# Altium project pca10031.PrjPCB
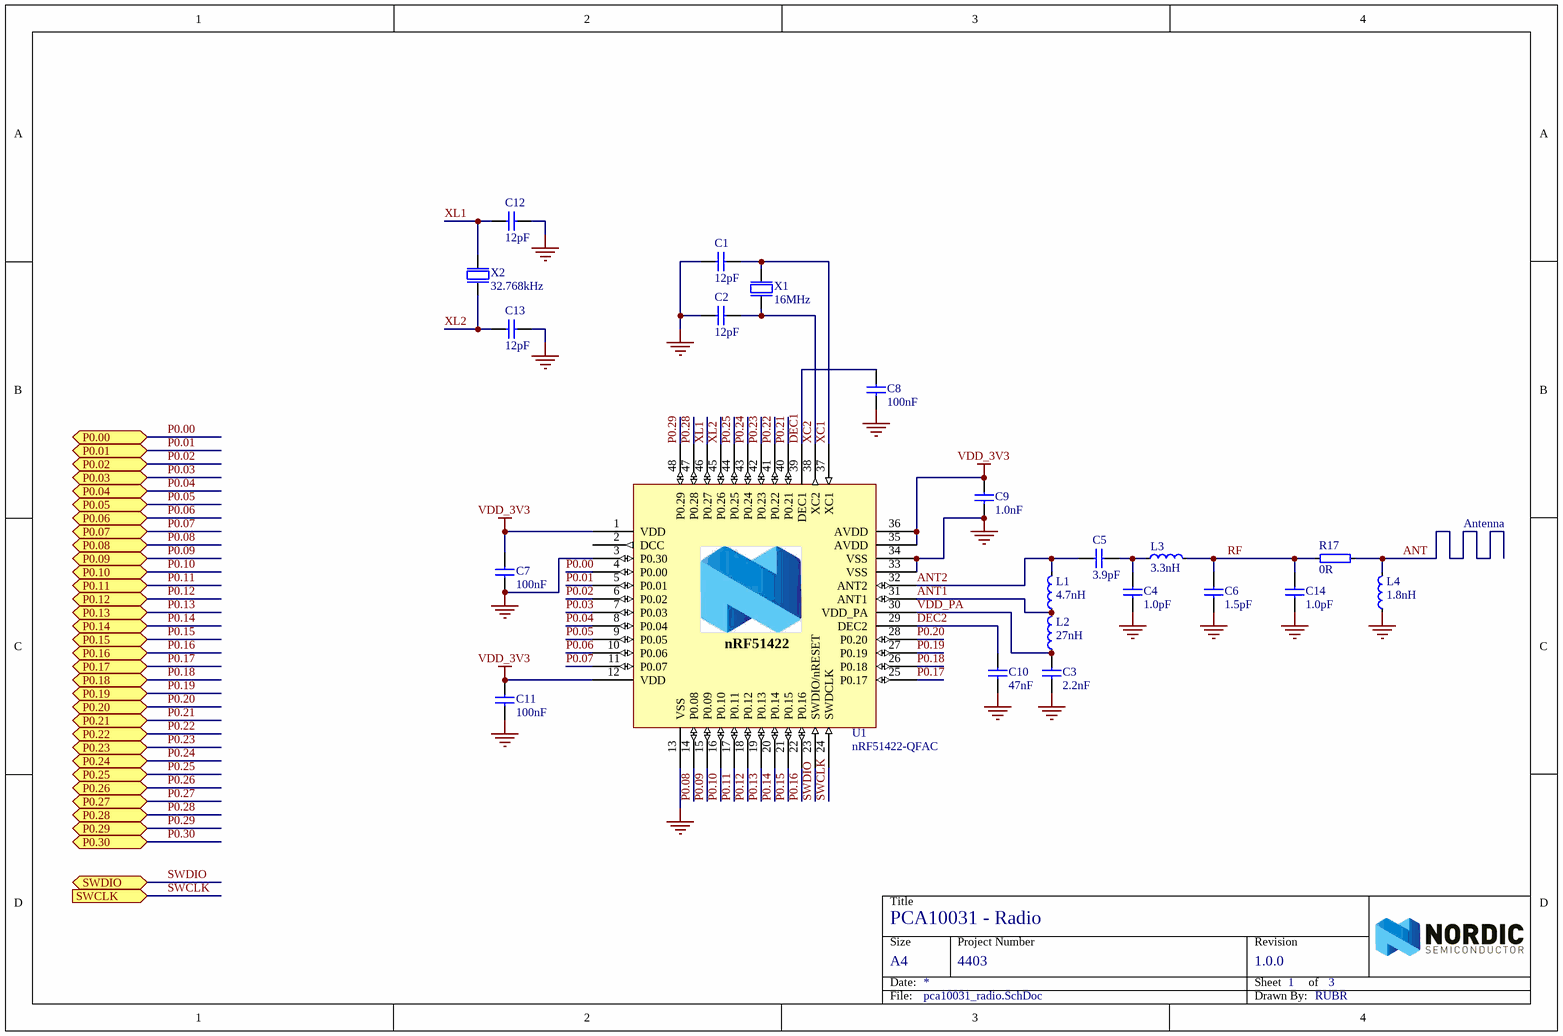
[diagram p0: pca10031_radio.SchDoc]
3 sheets, 78 parts. Net scope: flat (ports and power ports of the same name join across sheets).
Board file: 400101.PcbDoc
Sheets:
  pca10031_radio.SchDoc
  pca10031_interface_mcu.SchDoc
  pca10031_misc.SchDoc

## Sheet pca10031_radio.SchDoc: PCA10031 - Radio
size A4; Revision: 1.0.0; SheetNumber: 1; SheetTotal: 3; DrawnBy: RUBR; ProjectNumber: 4403; PCBRevision: 0168RUBR; DocumentSize: A4; PCAName: PCA10031; PCBNumber: 400101; ProjectName: Cost optimized nRF51-EK

### Parts
C1  12pF  [CAPC1005X04L]
C2  12pF  [CAPC1005X04L]
C3  2.2nF  [CAPC1005X04L]
C4  1.0pF  [CAPC1005X04L]
C5  3.9pF  [CAPC1005X04L]
C6  1.5pF  [CAPC1005X04L]
C7  100nF  [CAPC1005X04L]
C8  100nF  [CAPC1005X04L]
C9  1.0nF  [CAPC1005X04L]
C10  47nF  [CAPC1005X04L]
C11  100nF  [CAPC1005X04L]
C12  12pF  [CAPC1005X04L]
C13  12pF  [CAPC1005X04L]
C14  1.0pF  [CAPC1005X04L]
L1  4.7nH  [INDC1005X04L]
L2  27nH  [INDC1005X04L]
L3  3.3nH  [INDC1005X04L]
L4  1.8nH  [INDC1005X04L]
R17  0R  [RESC1005X04L]
U1  nRF51422-QFAC  [QFN40P600X600X90-48N]
X1  16MHz  [BT-XTAL_2520]
X2  32.768kHz  [XTAL_3215]

### Ports
P0.00 (bidir), P0.01 (bidir), P0.02 (bidir), P0.03 (bidir), P0.04 (bidir), P0.05 (bidir), P0.06 (bidir), P0.07 (bidir), P0.08 (bidir), P0.09 (bidir), P0.10 (bidir), P0.11 (bidir), P0.12 (bidir), P0.13 (bidir), P0.14 (bidir), P0.15 (bidir), P0.16 (bidir), P0.17 (bidir), P0.18 (bidir), P0.19 (bidir), P0.20 (bidir), P0.21 (bidir), P0.22 (bidir), P0.23 (bidir), P0.24 (bidir), P0.25 (bidir), P0.26 (bidir), P0.27 (bidir), P0.28 (bidir), P0.29 (bidir), P0.30 (bidir), SWCLK (in), SWDIO (bidir)

### Nets
GND: C1.2 C2.2 C3.2 C4.2 C6.2 C7.2 C8.2 C9.2 C10.2 C11.2 C12.2 C13.2 C14.2 L4.1 U1.3(P0.30) U1.13(VSS) U1.33(VSS) U1.34(VSS) U1.49 X1.2(GND) X1.4(GND)
VDD_3V3: C7.1 C9.1 C11.1 U1.1(VDD) U1.12(VDD) U1.35(AVDD) U1.36(AVDD)
ANT: L4.2 R17.2
ANT1: L1.1 L2.2 U1.31(ANT1)
ANT2: C5.1 L1.2 U1.32(ANT2)
DEC1: C8.1 U1.39(DEC1)
DEC2: C10.1 U1.29(DEC2)
P0.00: U1.4(P0.00) ; port P0.00
P0.01: U1.5(P0.01) ; port P0.01
P0.02: U1.6(P0.02) ; port P0.02
P0.03: U1.7(P0.03) ; port P0.03
P0.04: U1.8(P0.04) ; port P0.04
P0.05: U1.9(P0.05) ; port P0.05
P0.06: U1.10(P0.06) ; port P0.06
P0.07: U1.11(P0.07) ; port P0.07
P0.08: U1.14(P0.08) ; port P0.08
P0.09: U1.15(P0.09) ; port P0.09
P0.10: U1.16(P0.10) ; port P0.10
P0.11: U1.17(P0.11) ; port P0.11
P0.12: U1.18(P0.12) ; port P0.12
P0.13: U1.19(P0.13) ; port P0.13
P0.14: U1.20(P0.14) ; port P0.14
P0.15: U1.21(P0.15) ; port P0.15
P0.16: U1.22(P0.16) ; port P0.16
P0.17: U1.25(P0.17) ; port P0.17
P0.18: U1.26(P0.18) ; port P0.18
P0.19: U1.27(P0.19) ; port P0.19
P0.20: U1.28(P0.20) ; port P0.20
P0.21: U1.40(P0.21) ; port P0.21
P0.22: U1.41(P0.22) ; port P0.22
P0.23: U1.42(P0.23) ; port P0.23
P0.24: U1.43(P0.24) ; port P0.24
P0.25: U1.44(P0.25) ; port P0.25
P0.26: port P0.26
P0.27: port P0.27
P0.28: U1.47(P0.28) ; port P0.28
P0.29: U1.48(P0.29) ; port P0.29
P0.30: port P0.30
RF: C6.1 C14.1 L3.2 R17.1
SWCLK: U1.24(SWDCLK) ; port SWCLK
SWDIO: U1.23(SWDIO/nRESET) ; port SWDIO
VDD_PA: C3.1 L2.1 U1.30(VDD_PA)
XC1: C1.1 U1.37(XC1) X1.1(inp)
XC2: C2.1 U1.38(XC2) X1.3(out)
XL1: C12.1 U1.46(P0.27) X2.1(inp)
XL2: C13.1 U1.45(P0.26) X2.2(out)
NetC4_1: C4.1 C5.2 L3.1

Not connected (* = marked no-connect by the designer): U1 2(DCC)

### Notes on the sheet
- Antenna
- Title
- Size
- Date:
- Project Number
- Sheet         of
- Revision
- File:
- Drawn By:
- (in symbol nRF51422-QFAC-XLR3+) nRF51422

### Library data of the parts
C1 C2 C12 C13 = C0402-12p: Capacitor, NP0, ±2%; Note: 50V; Artikkelnr Noca: 20029159; Artikkelnr Simpro: N.A.; Part Number: C0402-12p; Manufacturer: *; Manufacturer Part Number: *; Datasheet: *; LatestRevisionDate: 2011-05-11; Pin Count: 2; Publisher: Nordic Semiconductor; Published: 2009-05-08; Value: 12pF; Supplier: *; Supplier part number: *; 2nd source Supplier: *; 2nd source part number: *; Footprint Doc: 0402
C3 = C0402-2n2: Capacitor, X7R, ±10%; Note: 50V; Artikkelnr Noca: 20039221; Artikkelnr Simpro: N.A.; Part Number: C0402-2n2; Manufacturer: *; Manufacturer Part Number: *; Datasheet: *; LatestRevisionDate: 2009-11-23; Pin Count: 2; Publisher: Nordic Semiconductor; Published: 2009-05-08; Value: 2.2nF; Supplier: *; Supplier part number: *; 2nd source Supplier: *; 2nd source part number: *; Footprint Doc: 0402
C4 C14 = C0402-1.0p: Capacitor, NP0, ±0.1pF; Note: 50V; Artikkelnr Noca: 20029140; Artikkelnr Simpro: N.A.; Part Number: C0402-1.0p; Manufacturer: *; Manufacturer Part Number: *; Datasheet: *; LatestRevisionDate: 2009-11-23; Pin Count: 2; Publisher: Nordic Semiconductor; Published: 2009-05-08; Value: 1.0pF; Supplier: *; Supplier part number: *; 2nd source Supplier: *; 2nd source part number: *; Footprint Doc: 0402
C5 = C0402-3.9p: Capacitor, NP0, ±0.1pF; Note: 50V; Artikkelnr Noca: N.A.; Part Number: C0402-3.9p; Manufacturer: *; Manufacturer Part Number: *; Datasheet: *; LatestRevisionDate: 2014-09-17; Pin Count: 2; Publisher: Nordic Semiconductor; Published: 2009-05-08; Value: 3.9pF; Supplier: *; Supplier part number: *; 2nd source Supplier: *; 2nd source part number: *; Footprint Doc: 0402; Artikkelnr Simpro: N.A.
C6 = C0402-1.5p: Capacitor, NP0, ±0.1pF; Note: 50V; Artikkelnr Noca: 20029139; Artikkelnr Simpro: N.A.; Part Number: C0402-1.5p; Manufacturer: *; Manufacturer Part Number: *; Datasheet: *; LatestRevisionDate: 2009-11-23; Pin Count: 2; Publisher: Nordic Semiconductor; Published: 2009-05-08; Value: 1.5pF; Supplier: *; Supplier part number: *; 2nd source Supplier: *; 2nd source part number: *; Footprint Doc: 0402
C7 C8 C11 = C0402-100n: Capacitor, X7R, ±10%; Note: 16V; Artikkelnr Noca: 20039200; Artikkelnr Simpro: N.A.; Part Number: C0402-100n; Manufacturer: *; Manufacturer Part Number: *; Datasheet: *; LatestRevisionDate: 2009-11-23; Pin Count: 2; Publisher: Nordic Semiconductor; Published: 2009-05-08; Value: 100nF; Supplier: *; Supplier part number: *; 2nd source Supplier: *; 2nd source part number: *; Footprint Doc: 0402
C9 = C0402-1n0: Capacitor, X7R, ±10%; Note: 50V; Artikkelnr Noca: 20039223; Artikkelnr Simpro: N.A.; Part Number: C0402-1n0; Manufacturer: *; Manufacturer Part Number: *; Datasheet: *; LatestRevisionDate: 2009-11-23; Pin Count: 2; Publisher: Nordic Semiconductor; Published: 2009-05-08; Value: 1.0nF; Supplier: *; Supplier part number: *; 2nd source Supplier: *; 2nd source part number: *; Footprint Doc: 0402
C10 = C0402-47n: Capacitor, X7R, ±10%; Note: Chip Cap 10%; Artikkelnr Noca: 20039389; Artikkelnr Simpro: N.A.; Part Number: C0402-47n; Manufacturer: *; Manufacturer Part Number: *; Datasheet: *; LatestRevisionDate: 2009-05-08; Pin Count: 2; Publisher: Nordic Semiconductor; Published: 2009-05-08; Value: 47nF; Supplier: *; Supplier part number: *; 2nd source Supplier: *; 2nd source part number: *; Footprint Doc: 0402
L1 = L0402-4n7: Inductor, 160mA, ±0.1nH; Manufacturer: Murata; Manufacturer Part Number: LQP15MN4N7B02D; Note: High frequency chip inductor ±5%; Artikkelnr Noca: 33029164; Artikkelnr Simpro: N.A.; Part Number: L0402-4n7; Datasheet: http://search.murata.co.jp/Ceramy/image/img/PDF/ENG/L0075S0084LQP15M.pdf; LatestRevisionDate: 2012-09-19; Pin Count: 2; Publisher: Nordic Semiconductor; Published: 2009-05-08; Value: 4.7nH; Supplier: Digi-Key; Supplier part number: 490-1132-1-ND; 2nd source Supplier: *; 2nd source part number: *; Footprint Doc: 0402
L2 = L0402-27n: Inductor, 70mA, ±2%; Manufacturer: Murata; Manufacturer Part Number: LQP15MN27NG02D; Note: High frequency chip inductor ±2%; Artikkelnr Noca: N.A.; Part Number: L0402-27n; Datasheet: http://search.murata.co.jp/Ceramy/image/img/PDF/ENG/L0075S0084LQP15M.pdf; LatestRevisionDate: 2014-09-17; Pin Count: 2; Publisher: Nordic Semiconductor; Published: 2014-06-12; Value: 27nH; Supplier: Digi-Key; Supplier part number: 490-6751-1-ND; 2nd source Supplier: *; 2nd source part number: *; Footprint Doc: 0402; Artikkelnr Simpro: N.A.
L3 = L0402-3n3: Inductor, 190mA, ±0.1nH; Manufacturer: Murata; Manufacturer Part Number: LQP15MN3N3B02D; Note: High frequency chip inductor ±5%; Artikkelnr Noca: 33029369; Artikkelnr Simpro: N.A.; Part Number: L0402-3n3; Datasheet: http://search.murata.co.jp/Ceramy/image/img/PDF/ENG/L0075S0084LQP15M.pdf; LatestRevisionDate: 2012-09-19; Pin Count: 2; Publisher: Nordic Semiconductor; Published: 2009-05-08; Value: 3.3nH; Supplier: Digi-Key; Supplier part number: 490-1130-1-ND; 2nd source Supplier: *; 2nd source part number: *; Footprint Doc: 0402
L4 = L0402-1n8: Inductor, 280mA, ±0.1nH; Manufacturer: Murata; Manufacturer Part Number: LQP15MN1N8B02D; Note: High frequency chip inductor ±5%; Artikkelnr Noca: 33029171; Artikkelnr Simpro: N.A.; Part Number: L0402-1n8; Datasheet: http://search.murata.co.jp/Ceramy/image/img/PDF/ENG/L0075S0084LQP15M.pdf; LatestRevisionDate: 2012-09-19; Pin Count: 2; Publisher: Nordic Semiconductor; Published: 2009-05-08; Value: 1.8nH; Supplier: Digi-Key; Supplier part number: 490-1127-1-ND; 2nd source Supplier: *; 2nd source part number: *; Footprint Doc: 0402
R17 = R0402-0R: Resistor, ±5%, 0.063W; Note: Chip Res 5%; Artikkelnr Noca: 27049000; Artikkelnr Simpro: N.A.; Part Number: R0402-0R; Manufacturer: *; Manufacturer Part Number: *; Datasheet: *; LatestRevisionDate: 2009-11-23; Pin Count: 2; Publisher: Nordic Semiconductor; Published: 2009-05-08; Value: 0R; Supplier: Farnell; Supplier part number: 146-9661; 2nd source Supplier: *; 2nd source part number: *; Footprint Doc: 0402
U1 = nRF51422-QFAC-XLR3+: Multi-protocol Bluetooth Low Energy, ANT and 2.4GHz proprietary system-on-chip; Manufacturer: Nordic Semiconductor; Manufacturer Part Number: nRF51422-QFACAx; Note: nRF51422 - QFN48 6x6 0.4mm pitch; Artikkelnr Noca: 15079264; Artikkelnr Simpro: N.A.; Part Number: nRF51422-QFAC-XLR3+; Datasheet: *; LatestRevisionDate: 2014-09-17; Pin Count: 48; Publisher: Nordic Semiconductor; Published: 2014-06-04; Value: nRF51422-QFAC; Supplier: Nordic Semiconductor; Supplier part number: *; 2nd source Supplier: *; 2nd source part number: *; Footprint Doc: QFN-48
X1 = NX2520SA-16MHZ-STD-CSW-5: XTAL SMD 2520, 16MHz, 8pF, ±15ppm; Manufacturer: NDK; Note: XTAL SMD 16.000MHz; Artikkelnr Noca: 22019192; Artikkelnr Simpro: N.A.; Part Number: NX2520SA-16MHZ-STD-CSW-5; Manufacturer Part Number: NX2520SA-16MHZ-STD-CSW-5; Datasheet: http://www.ndk.com/images/products/catalog/c_NX2520SA-STD-CSW-5_e.pdf; LatestRevisionDate: 2012-06-15; Pin Count: 4; Publisher: Nordic Semiconductor; Published: 2012-06-15; Value: 16MHz; Supplier: Digi-Key; Supplier part number: 644-1169-1-ND; 2nd source Supplier: *; 2nd source part number: *; Footprint Doc: BT-XTAL_2520
X2 = XTAL_FC-135 32.768k: EPSON TOYOCOM - FC-135 32.768KHZ ±20PPM,9.0PF - CRYSTAL, SM, WATCH; 2nd source part number: 127-8037; Note: XTAL SMD 32.768kHz, 3215; Artikkelnr Noca: 22019091; Artikkelnr Simpro: N.A.; Part Number: XTAL_FC-135 32.768k; Manufacturer: Epson Toyocom; Manufacturer Part Number: FC-135 32.768KHZ ±20PPM,9.0PF; Datasheet: http://www.farnell.com/datasheets/57480.pdf; LatestRevisionDate: 2014-03-27; Pin Count: 2; Publisher: Nordic Semiconductor; Published: 2010-10-18; Value: 32.768kHz; Supplier: Digi-Key; Supplier part number: FC-135 32.7680KA-AC-ND; 2nd source Supplier: Farnell; Footprint Doc: XTAL_3215

## Sheet pca10031_interface_mcu.SchDoc: PCA10031 - Interface MCU
size A3; Revision: 1.1.0; SheetNumber: 2; SheetTotal: 3; DrawnBy: RUBR; ProjectNumber: 4403; PCAName: PCA10031; PCBRevision: 0168RUBR; DocumentSize: A3; PCBNumber: 400101; ProjectName: Cost optimized nRF51-EK
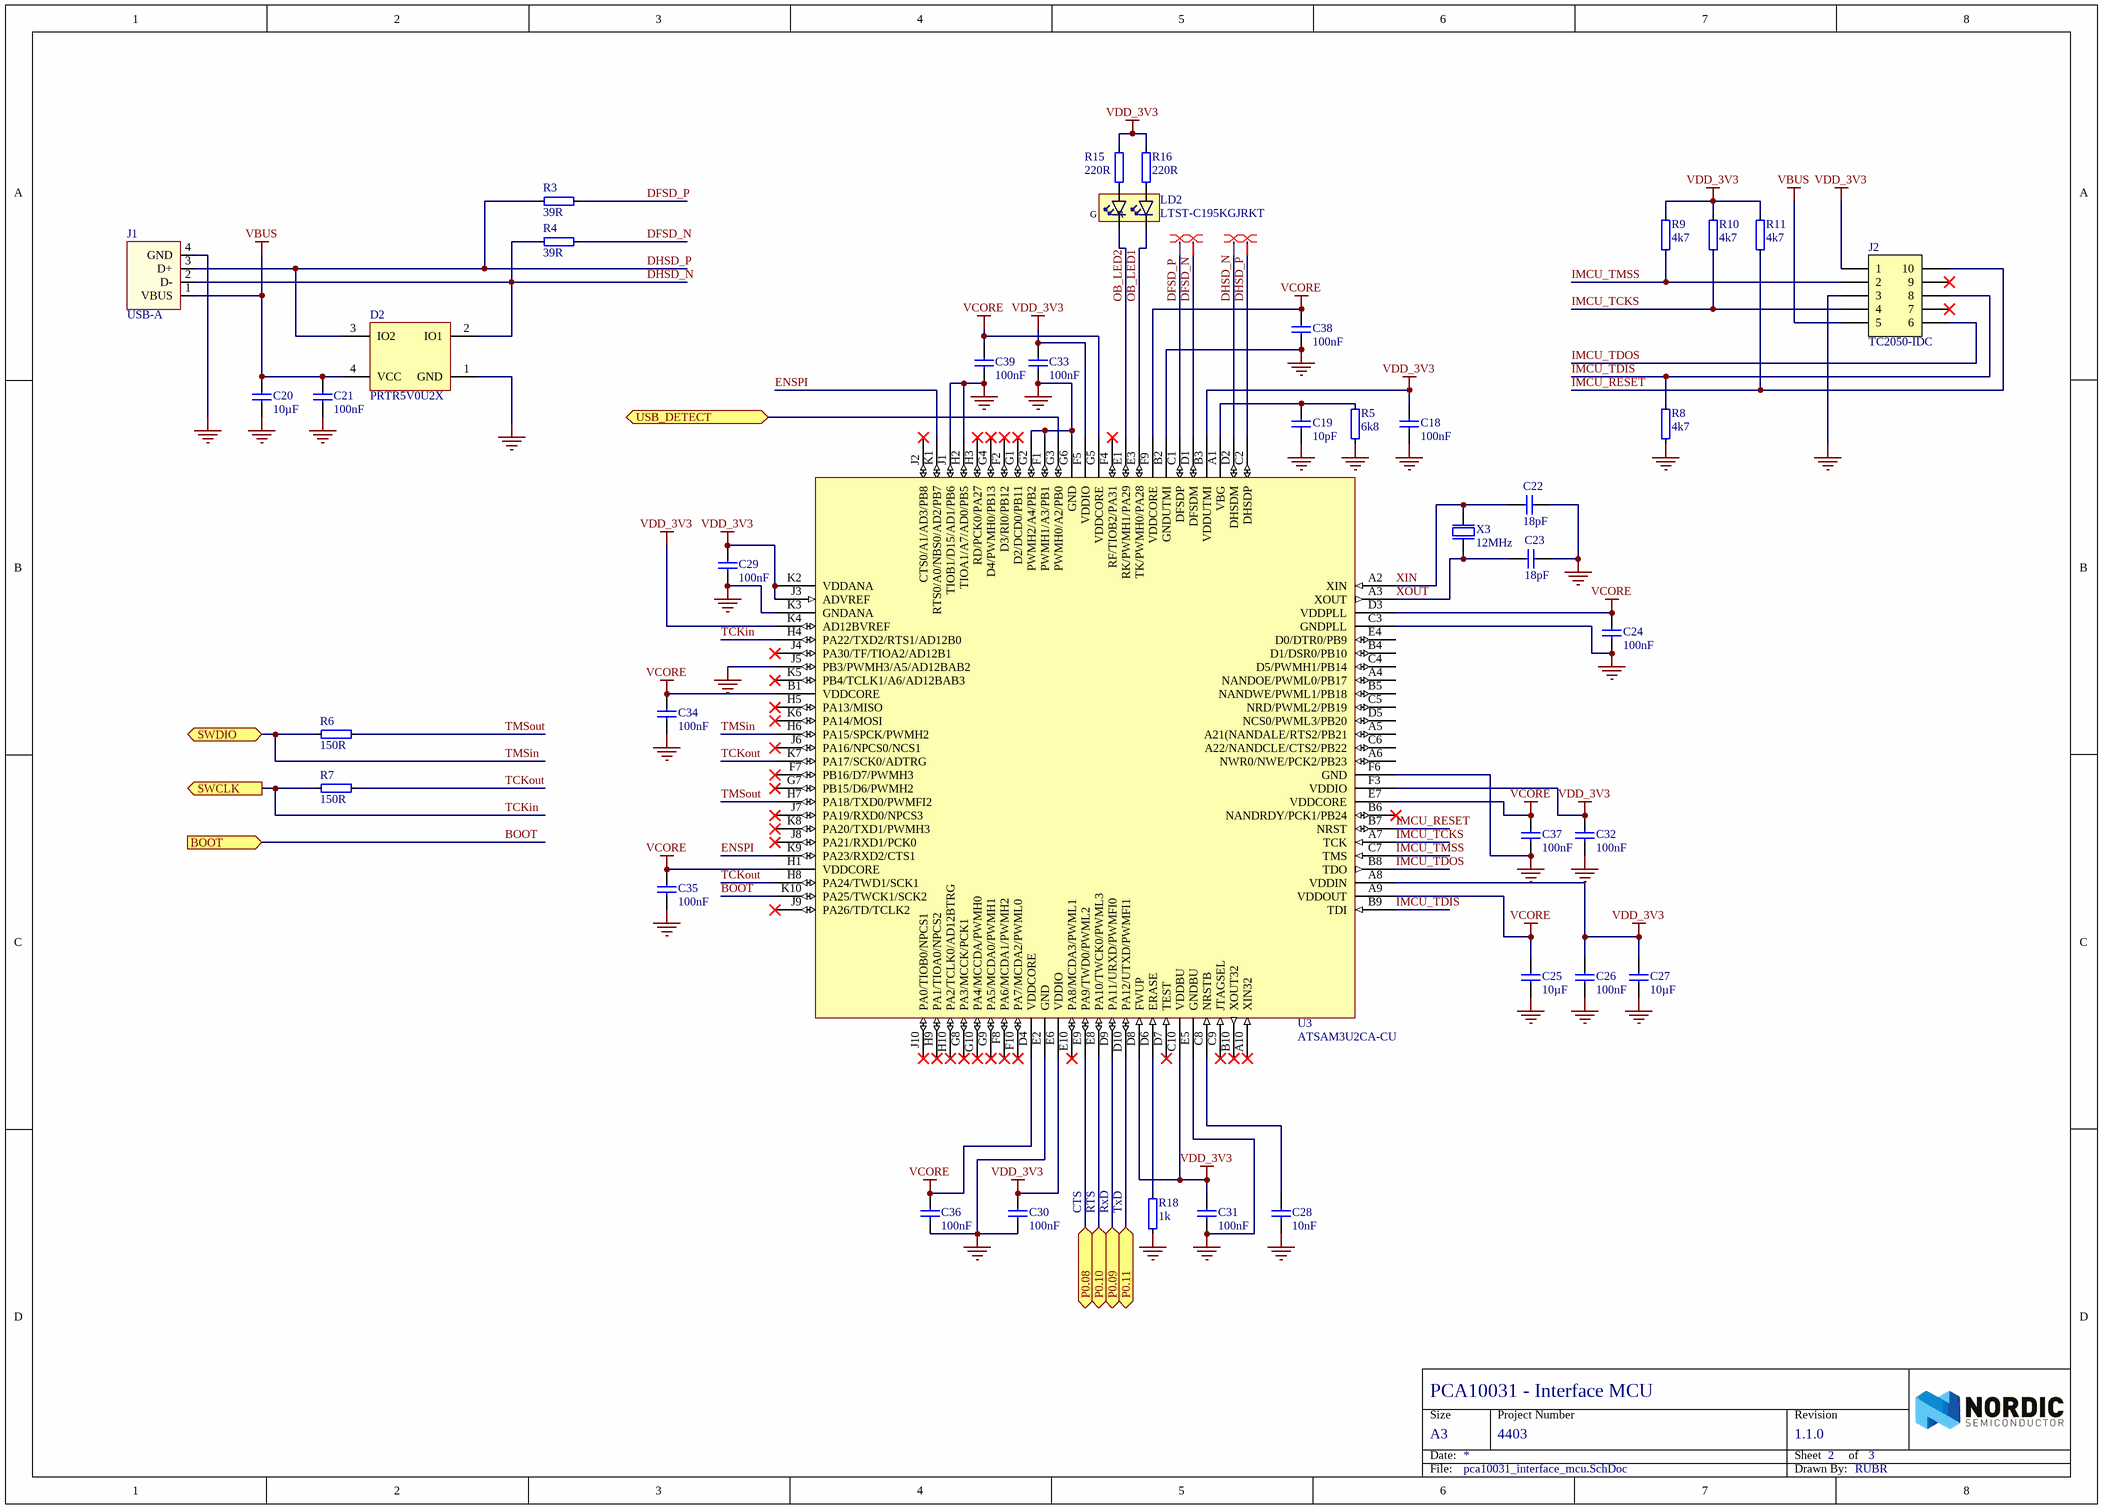
[diagram p1: pca10031_interface_mcu.SchDoc]

### Parts
C18  100nF  [CAPC1005X04L]
C19  10pF  [CAPC1005X04L]
C20  10µF  [CAPC1608X06L]
C21  100nF  [CAPC1005X04L]
C22  18pF  [CAPC1005X04L]
C23  18pF  [CAPC1005X04L]
C24  100nF  [CAPC1005X04L]
C25  10µF  [CAPC1608X06L]
C26  100nF  [CAPC1005X04L]
C27  10µF  [CAPC1608X06L]
C28  10nF  [CAPC1005X04L]
C29  100nF  [CAPC1005X04L]
C30  100nF  [CAPC1005X04L]
C31  100nF  [CAPC1005X04L]
C32  100nF  [CAPC1005X04L]
C33  100nF  [CAPC1005X04L]
C34  100nF  [CAPC1005X04L]
C35  100nF  [CAPC1005X04L]
C36  100nF  [CAPC1005X04L]
C37  100nF  [CAPC1005X04L]
C38  100nF  [CAPC1005X04L]
C39  100nF  [CAPC1005X04L]
D2  PRTR5V0U2X  [SOT190P230X110-4L]
J1  USB-A  [USB-A-PCB]  (no BOM)
J2  TC2050-IDC  [TC2050-IDC-NLFP]  (no BOM)
LD2  LTST-C195KGJRKT  [LED_DUAL_0606]
R3  39R  [RESC1005X04L]
R4  39R  [RESC1005X04L]
R5  6k8  [RESC1005X04L]
R6  150R  [RESC1005X04L]
R7  150R  [RESC1005X04L]
R8  4k7  [RESC1005X04L]
R9  4k7  [RESC1005X04L]
R10  4k7  [RESC1005X04L]
R11  4k7  [RESC1005X04L]
R15  220R  [RESC1005X04L]
R16  220R  [RESC1005X04L]
R18  1k  [RESC1005X04L]
U3  ATSAM3U2CA-CU  [BGA100C80P10X10_900X900X110]
X3  12MHz  [BT-XTAL_3225]

### Ports
BOOT (in), P0.08 (bidir), P0.09 (bidir), P0.10 (bidir), P0.11 (bidir), SWCLK (out), SWDIO (bidir), USB_DETECT (bidir)

### Nets
GND: C18.1 C19.1 C20.1 C21.1 C22.2 C23.2 C24.2 C25.1 C26.1 C27.1 C28.1 C29.1 C30.1 C31.1 C32.1 C33.1 C34.1 C35.1 C36.1 C37.1 C38.1 C39.1 D2.1(GND) J1.4(GND) J2.3 R5.1 R8.2 R18.1 U3.B2(GNDUTMI) U3.C3(GNDPLL) U3.E2(GND) U3.E5(GNDBU) U3.F1(PWMH1/A3/PB1) U3.F6(GND) U3.G2(PWMH2/A4/PB2) U3.G6(GND) U3.H2(TIOA1/A7/AD0/PB5) U3.J1(TIOB1/D15/AD1/PB6) U3.J5(PB3/PWMH3/A5/AD12BAB2) U3.K3(GNDANA) X3.2(GND) X3.4(GND)
VBUS: C20.2 C21.2 D2.4(VCC) J1.1(VBUS) J2.5
VCORE: C24.1 C25.2 C34.2 C35.2 C36.2 C37.2 C38.2 C39.2 U3.A9(VDDOUT) U3.B1(VDDCORE) U3.D3(VDDPLL) U3.D4(VDDCORE) U3.E7(VDDCORE) U3.F9(VDDCORE) U3.G5(VDDCORE) U3.H1(VDDCORE)
VDD_3V3: C18.2 C26.2 C27.2 C29.2 C30.2 C31.2 C32.2 C33.2 J2.1 R9.2 R10.2 R11.2 R15.1 R16.1 U3.A8(VDDIN) U3.B3(VDDUTMI) U3.C10(VDDBU) U3.D8(FWUP) U3.E6(VDDIO) U3.F3(VDDIO) U3.F5(VDDIO) U3.J3(ADVREF) U3.K2(VDDANA) U3.K4(AD12BVREF)
BOOT: U3.K10(PA25/TWCK1/SCK2) ; port BOOT
DFSD_N: R4.1 U3.D1(DFSDM)
DFSD_P: R3.1 U3.C1(DFSDP)
DHSD_N: D2.2(IO1) J1.2(D-) R4.2 U3.D2(DHSDM)
DHSD_P: D2.3(IO2) J1.3(D+) R3.2 U3.C2(DHSDP)
ENSPI: U3.K1(RTS0/A0/NBS0/AD2/PB7) U3.K9(PA23/RXD2/CTS1)
IMCU_RESET: J2.10 R11.1 U3.B7(NRST)
IMCU_TCKS: J2.4 R10.1 U3.A7(TCK)
IMCU_TDIS: J2.8 R8.1 U3.B9(TDI)
IMCU_TDOS: J2.6 U3.B8(TDO)
IMCU_TMSS: J2.2 R9.1 U3.C7(TMS)
OB_LED1: LD2.4(C1) U3.E3(TK/PWMH0/PA28)
OB_LED2: LD2.3(C2) U3.E1(RK/PWMH1/PA29)
P0.08: U3.E9(PA9/TWD0/PWML2) ; port P0.08
P0.09: U3.D9(PA11/URXD/PWMFI0) ; port P0.09
P0.10: U3.E8(PA10/TWCK0/PWML3) ; port P0.10
P0.11: U3.D10(PA12/UTXD/PWMFI1) ; port P0.11
TCKin: R7.2 U3.H4(PA22/TXD2/RTS1/AD12B0) ; port SWCLK  [project net SWCLK]
TCKout: R7.1 U3.H8(PA24/TWD1/SCK1) U3.K7(PA17/SCK0/ADTRG)
TMSin: R6.2 U3.H6(PA15/SPCK/PWMH2) ; port SWDIO  [project net SWDIO]
TMSout: R6.1 U3.H7(PA18/TXD0/PWMFI2)
XIN: C22.1 U3.A2(XIN) X3.1(inp)
XOUT: C23.1 U3.A3(XOUT) X3.3(out)
NetC19_2: C19.2 R5.2 U3.A1(VBG)
NetC28_2: C28.2 U3.C8(NRSTB)
NetLD2_1: LD2.1(A2) R15.2
NetLD2_2: LD2.2(A1) R16.2
NetR18_2: R18.2 U3.D6(ERASE)
NetR19_2: U3.G3(PWMH0/A2/PB0) ; port USB_DETECT

Not connected (* = marked no-connect by the designer): J2 7* 9*; U3 A4(NANDOE/PWML0/PB17) A5(A21(NANDALE/RTS2/PB21) A6(NWR0/NWE/PCK2/PB23) A10(XIN32)* B4(D1/DSR0/PB10) B5(NANDWE/PWML1/PB18) B6(NANDRDY/PCK1/PB24)* B10(XOUT32)* C4(D5/PWMH1/PB14) C5(NRD/PWML2/PB19) C6(A22/NANDCLE/CTS2/PB22) C9(JTAGSEL)* D5(NCS0/PWML3/PB20) D7(TEST)* E4(D0/DTR0/PB9) E10(PA8/MCDA3/PWML1)* F2(D3/RI0/PB12)* F4(RF/TIOB2/PA31)* F7(PB16/D7/PWMH3)* F8(PA6/MCDA1/PWMH2)* F10(PA7/MCDA2/PWML0)* G1(D2/DCD0/PB11)* G4(D4/PWMH0/PB13)* G7(PB15/D6/PWMH2)* G8(PA3/MCCK/PCK1)* G9(PA5/MCDA0/PWMH1)* G10(PA4/MCCDA/PWMH0)* H3(RD/PCK0/PA27)* H5(PA13/MISO)* H9(PA1/TIOA0/NPCS2)* H10(PA2/TCLK0/AD12BTRG)* J2(CTS0/A1/AD3/PB8)* J4(PA30/TF/TIOA2/AD12B1)* J6(PA16/NPCS0/NCS1)* J7(PA19/RXD0/NPCS3)* J8(PA21/RXD1/PCK0)* J9(PA26/TD/TCLK2)* J10(PA0/TIOB0/NPCS1)* K5(PB4/TCLK1/A6/AD12BAB3)* K6(PA14/MOSI)* K8(PA20/TXD1/PWMH3)*

### Layout directives
differential pair: DFSD_N, DFSD_P, DHSD_N, DHSD_P

### Notes on the sheet
- CTS
- RTS
- (near R18) RxD
- (near R18) TxD
- Size
- Date:
- Project Number
- Sheet         of
- Revision
- File:
- Drawn By:
- (in symbol LTST-C195KGJRKT) G; R

### Library data of the parts
C18 C21 C24 C26 C29-C39 = C0402-100n: as C7 on sheet pca10031_radio; Part Number: C0402-100n; Manufacturer: *; Manufacturer Part Number: *; Datasheet: *; LatestRevisionDate: 2009-11-23; Pin Count: 2; Publisher: Nordic Semiconductor; Published: 2009-05-08; Value: 100nF; Supplier: *; Supplier part number: *; 2nd source Supplier: *; 2nd source part number: *; Footprint Doc: 0402
C19 = C0402-10p: Capacitor, NP0, ±2%; 2nd source part number: 185-6064; Note: 50V; Artikkelnr Noca: 20029260; Artikkelnr Simpro: N.A.; Part Number: C0402-10p; Manufacturer: *; Manufacturer Part Number: *; Datasheet: *; LatestRevisionDate: 2009-05-08; Pin Count: 2; Publisher: Nordic Semiconductor; Published: 2009-05-08; Value: 10pF; Supplier: Digi-Key; Supplier part number: 712-1252-1-ND; 2nd source Supplier: Farnell; Footprint Doc: 0402
C20 C25 C27 = C0603-10µ: Capacitor, X5R, ±20%; Note: 6.3V; Artikkelnr Noca: 20039234; Artikkelnr Simpro: N.A.; Part Number: C0603-10µ; Manufacturer: *; Manufacturer Part Number: *; Datasheet: *; LatestRevisionDate: 2011-01-17; Pin Count: 2; Publisher: Nordic Semiconductor; Published: 2011-01-17; Value: 10µF; Supplier: *; Supplier part number: *; 2nd source Supplier: *; 2nd source part number: *; Footprint Doc: 0603
C22 C23 = C0402-18p: Capacitor, NP0, ±5%; Note: 50V; Artikkelnr Noca: 20029209; Artikkelnr Simpro: N.A.; Part Number: C0402-18p; Manufacturer: *; Manufacturer Part Number: *; Datasheet: *; LatestRevisionDate: 2009-05-08; Pin Count: 2; Publisher: Nordic Semiconductor; Published: 2009-05-08; Value: 18pF; Supplier: *; Supplier part number: *; 2nd source Supplier: *; 2nd source part number: *; Footprint Doc: 0402
C28 = C0402-10n: Capacitor, X7R, ±10%; Note: 16V; Artikkelnr Noca: 20039166; Artikkelnr Simpro: N.A.; Part Number: C0402-10n; Manufacturer: *; Manufacturer Part Number: *; Datasheet: *; LatestRevisionDate: 2009-11-23; Pin Count: 2; Publisher: Nordic Semiconductor; Published: 2009-05-08; Value: 10nF; Supplier: *; Supplier part number: *; 2nd source Supplier: *; 2nd source part number: *; Footprint Doc: 0402
D2 = PRTR5V0U2X: Ultra low capacitance double rail-to-rail ESD protection diode; Manufacturer: NXP; 2nd source part number: 152-4157; Artikkelnr Noca: 10069015; Artikkelnr Simpro: N.A.; Part Number: PRTR5V0U2X; Manufacturer Part Number: PRTR5V0U2X; Datasheet: http://www.farnell.com/datasheets/109718.pdf; LatestRevisionDate: 2012-06-11; Publisher: Nordic Semiconductor; Published: 2012-06-11; Value: PRTR5V0U2X; Note: *; Supplier: Digi-Key; Supplier part number: 568-4140-1-ND; 2nd source Supplier: Farnell; Footprint Doc: SOT-143B
J1 = USB-A-PCB: USB-A PCB footprint; Artikkelnr Noca: N.A.; Part Number: USB-A-PCB; Manufacturer: *; Manufacturer Part Number: *; Datasheet: *; LatestRevisionDate: 2014-06-04; Pin Count: 4; Publisher: Nordic Semiconductor; Published: 2014-06-04; Value: USB-A; Note: *; Supplier: *; Supplier part number: *; 2nd source Supplier: *; 2nd source part number: *; Footprint Doc: USB-A-PCB; Artikkelnr Simpro: N.A.
J2 = TC2050-IDC-NLFP: CBL PLUG-OF-NAILS 10-PIN; Manufacturer: Tag-Connect LLC; Artikkelnr Noca: N.A.; Part Number: TC2050-IDC-NLFP; Manufacturer Part Number: TC2050-IDC-NLFP; Datasheet: http://www.tag-connect.com/Materials/TC2050-IDC%20Datasheet.pdf; LatestRevisionDate: 2012-11-21; Publisher: Nordic Semiconductor; Published: 2012-11-21; Value: TC2050-IDC; Supplier: Digi-Key; Supplier part number: TC2050-IDC-NL-ND; 2nd source Supplier: *; 2nd source part number: *; Pin Count: 10; Footprint Doc: TC2050-IDC-NLFP; Artikkelnr Simpro: N.A.
LD2 = LTST-C195KGJRKT: Ultra bright AlInGaP Bi-Color LED; Manufacturer: Lite-On Inc; 2nd source part number: 859-LTST-C195KGJRKT; Artikkelnr Noca: 13019145; Artikkelnr Simpro: N.A.; Part Number: LTST-C195KGJRKT; Manufacturer Part Number: LTST-C195KGJRKT; Datasheet: http://media.digikey.com/pdf/Data%20Sheets/Lite-On%20PDFs/LTST-C195KGJRKT.pdf; LatestRevisionDate: 2013-02-11; Pin Count: 4; Publisher: Nordic Semiconductor; Published: 2012-07-05; Value: LTST-C195KGJRKT; Note: *; Supplier: Digi-Key; Supplier part number: 160-1452-1-ND; 2nd source Supplier: Mouser; Footprint Doc: LED_DUAL_0606
R3 R4 = R0402-39R: Resistor, ±1%, 0.063W; Note: Chip Res 1%; Artikkelnr Noca: 27049039; Artikkelnr Simpro: N.A.; Value: 39R; Part Number: R0402-39R; Manufacturer: *; Manufacturer Part Number: *; Datasheet: *; LatestRevisionDate: 2009-11-23; Pin Count: 2; Publisher: Nordic Semiconductor; Published: 2009-05-08; Supplier: Farnell; Supplier part number: 173-8831; 2nd source Supplier: *; 2nd source part number: *; Footprint Doc: 0402
R5 = R0402-6k8: Resistor, ±1%, 0.063W; Note: Chip Res 1%; Artikkelnr Noca: 27049093; Artikkelnr Simpro: N.A.; Part Number: R0402-6k8; Manufacturer: *; Manufacturer Part Number: *; Datasheet: *; LatestRevisionDate: 2009-11-23; Pin Count: 2; Publisher: Nordic Semiconductor; Published: 2009-05-08; Value: 6k8; Supplier: Farnell; Supplier part number: 173-8862; 2nd source Supplier: *; 2nd source part number: *; Footprint Doc: 0402
R6 R7 = R0402-150: Resistor, ±1%, 0.063W; Note: Chip Res 1%; Artikkelnr Noca: 27049053; Artikkelnr Simpro: N.A.; Part Number: R0402-150; Manufacturer: *; Manufacturer Part Number: *; Datasheet: *; LatestRevisionDate: 2009-11-23; Pin Count: 2; Publisher: Nordic Semiconductor; Published: 2009-05-08; Value: 150R; Supplier: Farnell; Supplier part number: 173-8839; 2nd source Supplier: *; 2nd source part number: *; Footprint Doc: 0402
R8-R11 = R0402-4k7: Resistor, ±1%, 0.063W; Note: Chip Res 1%; Artikkelnr Noca: 27049089; Artikkelnr Simpro: N.A.; Part Number: R0402-4k7; Manufacturer: *; Manufacturer Part Number: *; Datasheet: *; LatestRevisionDate: 2009-11-23; Pin Count: 2; Publisher: Nordic Semiconductor; Published: 2009-05-08; Value: 4k7; Supplier: Farnell; Supplier part number: 173-8858; 2nd source Supplier: *; 2nd source part number: *; Footprint Doc: 0402
R15 R16 = R0402-220: Resistor, ±1%, 0.063W; Note: Chip Res 1%; Artikkelnr Noca: 27049057; Artikkelnr Simpro: N.A.; Part Number: R0402-220; Manufacturer: *; Manufacturer Part Number: *; Datasheet: *; LatestRevisionDate: 2009-11-23; Pin Count: 2; Publisher: Nordic Semiconductor; Published: 2009-05-08; Value: 220R; Supplier: Farnell; Supplier part number: 173-8841; 2nd source Supplier: *; 2nd source part number: *; Footprint Doc: 0402
R18 = R0402-1k0: Resistor, ±1%, 0.063W; Note: Chip Res 1%; Artikkelnr Noca: 27049073; Artikkelnr Simpro: N.A.; Part Number: R0402-1k0; Manufacturer: *; Manufacturer Part Number: *; Datasheet: *; LatestRevisionDate: 2009-11-23; Pin Count: 2; Publisher: Nordic Semiconductor; Published: 2009-05-08; Value: 1k; Supplier: Farnell; Supplier part number: 173-8850; 2nd source Supplier: *; 2nd source part number: *; Footprint Doc: 0402
U3 = ATSAM3U2CA-CU: IC MCU 32bit 128kB flash 100TFBGA; Manufacturer: Atmel; 2nd source part number: 556-ATSAM3U2CA-CU; Artikkelnr Noca: 15019072; Artikkelnr Simpro: N.A.; Part Number: ATSAM3U2CA-CU; Manufacturer Part Number: ATSAM3U2CA-CU; Datasheet: http://www.atmel.com/Images/6430s.pdf; LatestRevisionDate: 2012-06-01; Pin Count: 100; Publisher: Nordic Semiconductor; Published: 2012-06-01; Value: ATSAM3U2CA-CU; Note: *; Supplier: Digi-Key; Supplier part number: ATSAM3U2CA-CU-ND; 2nd source Supplier: Mouser; Footprint Doc: TFBGA100
X3 = XTAL SMD 12MHz (3225): XTAL SMD 3225, 12MHz, 18pF, ±30ppm; Manufacturer: TXC Corporation; Manufacturer Part Number: 7M-12.000MAAJ-T; 2nd source part number: 184-2056; Note: XTAL SMD 12.000MHz; Artikkelnr Noca: 22019166; Artikkelnr Simpro: N.A.; Part Number: XTAL SMD 12MHz (3225); Datasheet: http://www.txccrystal.com/images/pdf/7m.pdf; LatestRevisionDate: 2010-08-31; Pin Count: 4; Publisher: Nordic Semiconductor; Published: 2010-08-31; Value: 12MHz; Supplier: Digi-Key; Supplier part number: 887-1121-1-ND; 2nd source Supplier: Farnell; Footprint Doc: BT-XTAL_3225

## Sheet pca10031_misc.SchDoc: PCA10031 - Miscellaneous Components and Interfaces
size A4; Revision: 1.1.0; SheetNumber: 3; SheetTotal: 3; DrawnBy: RUBR; ProjectNumber: 4403; PCBRevision: 0168RUBR; DocumentSize: A4; PCAName: PCA10031; PCBNumber: 400101; ProjectName: Cost optimized nRF51-EK
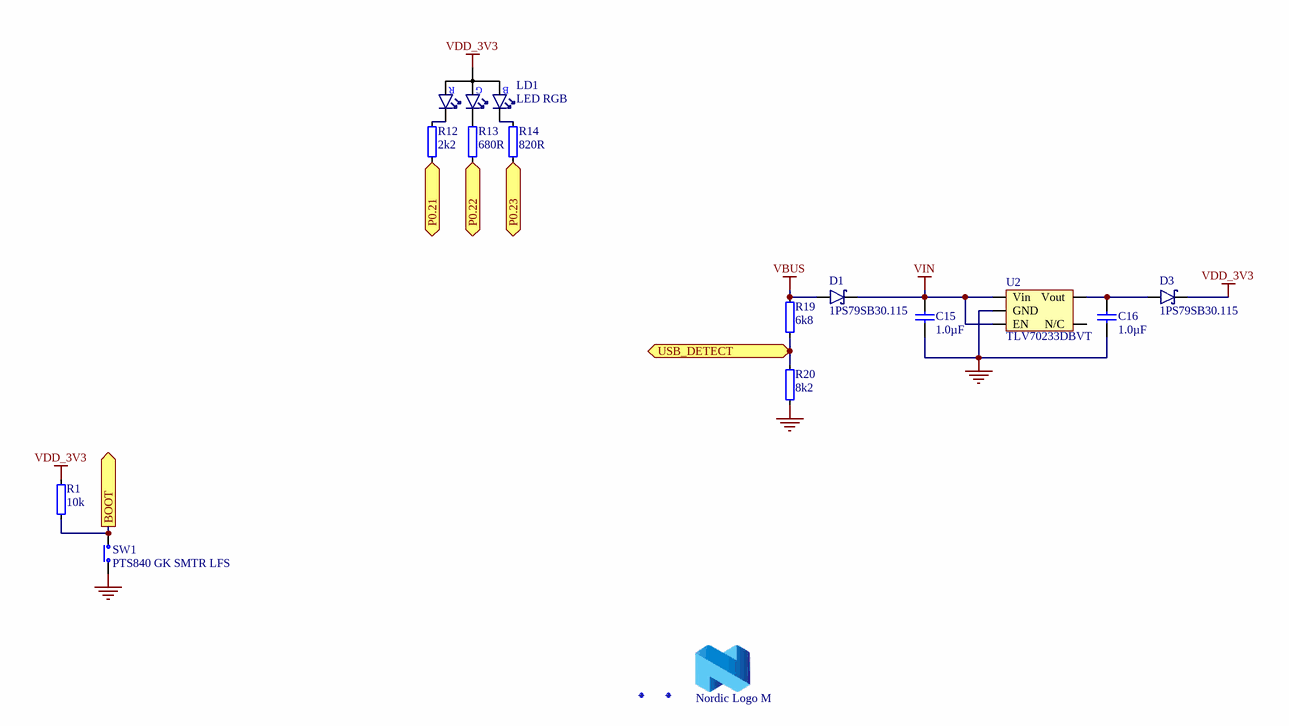
[diagram p2: pca10031_misc.SchDoc]

### Parts
C15  1.0µF  [CAPC1608X06L]
C16  1.0µF  [CAPC1608X06L]
D1  1PS79SB30.115  [SOD-523]
D3  1PS79SB30.115  [SOD-523]
Fid1  Fiducial mark  [Fiducial]  (value not drawn)
Fid2  Fiducial mark  [Fiducial]  (value not drawn)
LD1  LED RGB  [SML-LX0404SIUPGUSB]
LOGO1  Nordic Logo M  [NORDIC_LOGO_M]  (no BOM)
R1  10k  [RESC1005X04L]
R12  2k2  [RESC1005X04L]
R13  680R  [RESC1005X04L]
R14  820R  [RESC1005X04L]
R19  6k8  [RESC1005X04L]
R20  8k2  [RESC1005X04L]
SW1  PTS840 GK SMTR LFS  [EVQP7A/J/B/K]
U2  TLV70233DBVT  [SOT-23-5]

### Ports
BOOT (out), P0.21 (bidir), P0.22 (bidir), P0.23 (bidir), USB_DETECT (bidir)

### Nets
GND: C15.1 C16.1 R20.2 SW1.2(COM) U2.2(GND)
VBUS: D1.1(A) R19.1
VDD_3V3: D3.3(C) LD1.4(A) R1.2
VIN: C15.2 D1.3(C) U2.1(Vin) U2.3(EN)
BOOT: R1.1 SW1.1(N.O) ; port BOOT
P0.21: R12.1 ; port P0.21
P0.22: R13.1 ; port P0.22
P0.23: R14.1 ; port P0.23
NetC16_2: C16.2 D3.1(A) U2.5(Vout)
NetLD1_1: LD1.1(C_RED) R12.2
NetLD1_2: LD1.2(C_GREEN) R13.2
NetLD1_3: LD1.3(C_BLUE) R14.2
NetR19_2: R19.2 R20.1 ; port USB_DETECT

Not connected (* = marked no-connect by the designer): U2 4(N/C)

### Notes on the sheet
- Title
- Size
- Date:
- Project Number
- Sheet         of
- Revision
- File:
- Drawn By:
- (in symbol SML-LX0404SIUPGUSB) R; G; B

### Library data of the parts
C15 C16 = C0603-1µ0: Capacitor, X7R, ±10%; Note: 16V; Artikkelnr Noca: 20039335; Artikkelnr Simpro: N.A.; Published: 2009-05-08; LatestRevisionDate: 2013-06-05; Publisher: Nordic Semiconductor; Value: 1.0µF; Part Number: C0603-1µ0; Manufacturer: *; Manufacturer Part Number: *; Datasheet: *; Pin Count: 2; Supplier: *; Supplier part number: *; 2nd source Supplier: *; 2nd source part number: *; Footprint Doc: 0603
D1 D3 = 1PS79SB30.115: Diode Schottky Vf=0.38, Vr=40V, If=200mA, Ir=500nA; Manufacturer: NXP; Artikkelnr Noca: N.A.; Part Number: 1PS79SB30.115; Manufacturer Part Number: 1PS79SB30.115; Datasheet: http://www.nxp.com/documents/data_sheet/1PS79SB30.pdf; Footprint Doc: SOD-523; LatestRevisionDate: 2014-09-24; Pin Count: 2; Publisher: Nordic Semiconductor; Published: 2014-09-24; Value: 1PS79SB30.115; Note: *; Supplier: Digi-Key; Supplier part number: 568-5973-1-ND; 2nd source Supplier: *; 2nd source part number: *; Artikkelnr Simpro: N.A.
Fid1 Fid2 = Fid-Mark: Artikkelnr Noca: N.A.; Part Number: Fid-Mark; Manufacturer: *; Manufacturer Part Number: *; Datasheet: *; LatestRevisionDate: 2009-12-12; Pin Count: 1; Publisher: Nordic Semiconductor; Published: 2009-12-12; Value: *; Note: *; Supplier: *; Supplier part number: *; 2nd source Supplier: *; 2nd source part number: *; Footprint Doc: Fiducial; Artikkelnr Simpro: N.A.
LD1 = SML-LX0404SIUPGUSB: RGB LED 1.00 mm x 1.00 mm SMD; Manufacturer: Lumex; 2nd source part number: 211-8843; Artikkelnr Noca: 13019150; Artikkelnr Simpro: N.A.; Part Number: SML-LX0404SIUPGUSB; Manufacturer Part Number: SML-LX0404SIUPGUSB; Datasheet: http://media.digikey.com/pdf/Data%20Sheets/Lumex%20PDFs/SML-LX0404SIUPGUSB.pdf; LatestRevisionDate: 2012-10-08; Pin Count: 4; Publisher: Nordic Semiconductor; Published: 2012-10-08; Value: LED RGB; Note: *; Supplier: Digi-Key; Supplier part number: 67-2125-1-ND; 2nd source Supplier: Farnell; Footprint Doc: SML-LX0404SIUPGUSB
LOGO1 = Nordic Logo M: Nordic Logo, medium size; Artikkelnr Noca: N.A.; Part Number: Nordic Logo M; Manufacturer: *; Manufacturer Part Number: *; Datasheet: *; LatestRevisionDate: 2010-02-18; Publisher: Nordic Semiconductor; Value: Nordic Logo M; Note: *; Supplier: *; Supplier part number: *; 2nd source Supplier: *; 2nd source part number: *; Pin Count: 2; Published: 2010-02-18; Footprint Doc: NORDIC_LOGO_M; Artikkelnr Simpro: N.A.
R1 = R0402-10k: Resistor, ±1%, 0.063W; Note: Chip Res 1%; Artikkelnr Noca: 27049097; Artikkelnr Simpro: N.A.; Part Number: R0402-10k; Manufacturer: *; Manufacturer Part Number: *; Datasheet: *; LatestRevisionDate: 2009-11-23; Pin Count: 2; Publisher: Nordic Semiconductor; Published: 2009-05-08; Value: 10k; Supplier: Farnell; Supplier part number: 173-8864; 2nd source Supplier: *; 2nd source part number: *; Footprint Doc: 0402
R12 = R0402-2k2: Resistor, ±1%, 0.063W; Note: Chip Res 1%; Artikkelnr Noca: 27049081; Artikkelnr Simpro: N.A.; Part Number: R0402-2k2; Manufacturer: *; Manufacturer Part Number: *; Datasheet: *; LatestRevisionDate: 2009-11-23; Pin Count: 2; Publisher: Nordic Semiconductor; Published: 2009-05-08; Value: 2k2; Supplier: Farnell; Supplier part number: 173-8854; 2nd source Supplier: *; 2nd source part number: *; Footprint Doc: 0402
R13 = R0402-680: Resistor, ±1%, 0.063W; Note: Chip Res 1%; Artikkelnr Noca: 27049069; Artikkelnr Simpro: N.A.; Part Number: R0402-680; Manufacturer: *; Manufacturer Part Number: *; Datasheet: *; LatestRevisionDate: 2009-11-23; Pin Count: 2; Publisher: Nordic Semiconductor; Published: 2009-05-08; Value: 680R; Supplier: Farnell; Supplier part number: 173-8848; 2nd source Supplier: *; 2nd source part number: *; Footprint Doc: 0402
R14 = R0402-820: Resistor, ±1%, 0.063W; Note: Chip Res 1%; Artikkelnr Noca: 27049071; Artikkelnr Simpro: N.A.; Part Number: R0402-820; Manufacturer: *; Manufacturer Part Number: *; Datasheet: *; LatestRevisionDate: 2009-11-23; Pin Count: 2; Publisher: Nordic Semiconductor; Published: 2009-05-08; Value: 820R; Supplier: Farnell; Supplier part number: 173-8849; 2nd source Supplier: *; 2nd source part number: *; Footprint Doc: 0402
R19 = R0402-6k8: as R5 on sheet pca10031_interface_mcu; Part Number: R0402-6k8; Manufacturer: *; Manufacturer Part Number: *; Datasheet: *; LatestRevisionDate: 2009-11-23; Pin Count: 2; Publisher: Nordic Semiconductor; Published: 2009-05-08; Value: 6k8; Supplier: Farnell; Supplier part number: 173-8862; 2nd source Supplier: *; 2nd source part number: *; Footprint Doc: 0402
R20 = R0402-8k2: Resistor, ±1%, 0.063W; Note: Chip Res 1%; Artikkelnr Noca: 27049095; Artikkelnr Simpro: N.A.; Part Number: R0402-8k2; Manufacturer: *; Manufacturer Part Number: *; Datasheet: *; LatestRevisionDate: 2009-11-23; Pin Count: 2; Publisher: Nordic Semiconductor; Published: 2009-05-08; Value: 8k2; Supplier: Farnell; Supplier part number: 173-8863; 2nd source Supplier: *; 2nd source part number: *; Footprint Doc: 0402
SW1 = PTS840 GK SMTR LFS: Microminiature SMT Switch, Side Actuated; Manufacturer: C & K; 2nd source part number: 611-PTS840GKSMTR; Note: Tactile Switch, SPST, SMD, 220gf; Artikkelnr Noca: 50019089; Artikkelnr Simpro: N.A.; Part Number: PTS840 GK SMTR LFS; Manufacturer Part Number: PTS840 GK SMTR LFS; Datasheet: http://www.ck-components.com/80185/pts840_11june13.pdf/; LatestRevisionDate: 2014-09-17; Pin Count: 4; Publisher: Nordic Semiconductor; Published: 2014-08-12; Value: PTS840 GK SMTR LFS; Supplier: Digi-Key; Supplier part number: CKN10508CT-ND; 2nd source Supplier: Mouser; Footprint Doc: PTS840 Gx
U2 = TLV70233DBVT: IC REG LDO 3.3V 300MA SOT23-5; Manufacturer: Texas Instruments; Note: 300-mA, Low-IQ, Low-Dropout Regulator; Artikkelnr Noca: 17039215; Artikkelnr Simpro: N.A.; Part Number: TLV70233DBVT; Manufacturer Part Number: TLV70233DBVT; Datasheet: http://www.ti.com/lit/ds/symlink/tlv70218.pdf; LatestRevisionDate: 2012-07-06; Pin Count: 5; Publisher: Nordic Semiconductor; Published: 2012-07-06; Value: TLV70233DBVT; Supplier: Digi-Key; Supplier part number: 296-27895-1-ND; 2nd source Supplier: *; 2nd source part number: *; Footprint Doc: SOT-23-5

## Nets that join several sheets
GND: pca10031_radio (21 pins), pca10031_interface_mcu (42 pins), pca10031_misc (5 pins)
VBUS: pca10031_interface_mcu (5 pins), pca10031_misc (D1.1 R19.1)
VDD_3V3: pca10031_radio (7 pins), pca10031_interface_mcu (24 pins), pca10031_misc (D3.3 LD1.4 R1.2)
BOOT: pca10031_interface_mcu (U3.K10), pca10031_misc (R1.1 SW1.1)
NetR19_2: pca10031_interface_mcu (U3.G3), pca10031_misc (R19.2 R20.1)
P0.08: pca10031_radio (U1.14), pca10031_interface_mcu (U3.E9)
P0.09: pca10031_radio (U1.15), pca10031_interface_mcu (U3.D9)
P0.10: pca10031_radio (U1.16), pca10031_interface_mcu (U3.E8)
P0.11: pca10031_radio (U1.17), pca10031_interface_mcu (U3.D10)
P0.21: pca10031_radio (U1.40), pca10031_misc (R12.1)
P0.22: pca10031_radio (U1.41), pca10031_misc (R13.1)
P0.23: pca10031_radio (U1.42), pca10031_misc (R14.1)
SWCLK: pca10031_radio (U1.24), pca10031_interface_mcu (R7.2 U3.H4)
SWDIO: pca10031_radio (U1.23), pca10031_interface_mcu (R6.2 U3.H6)